# EasyEDA Pro project 无刷电调.epro

# Schematic Schematic1
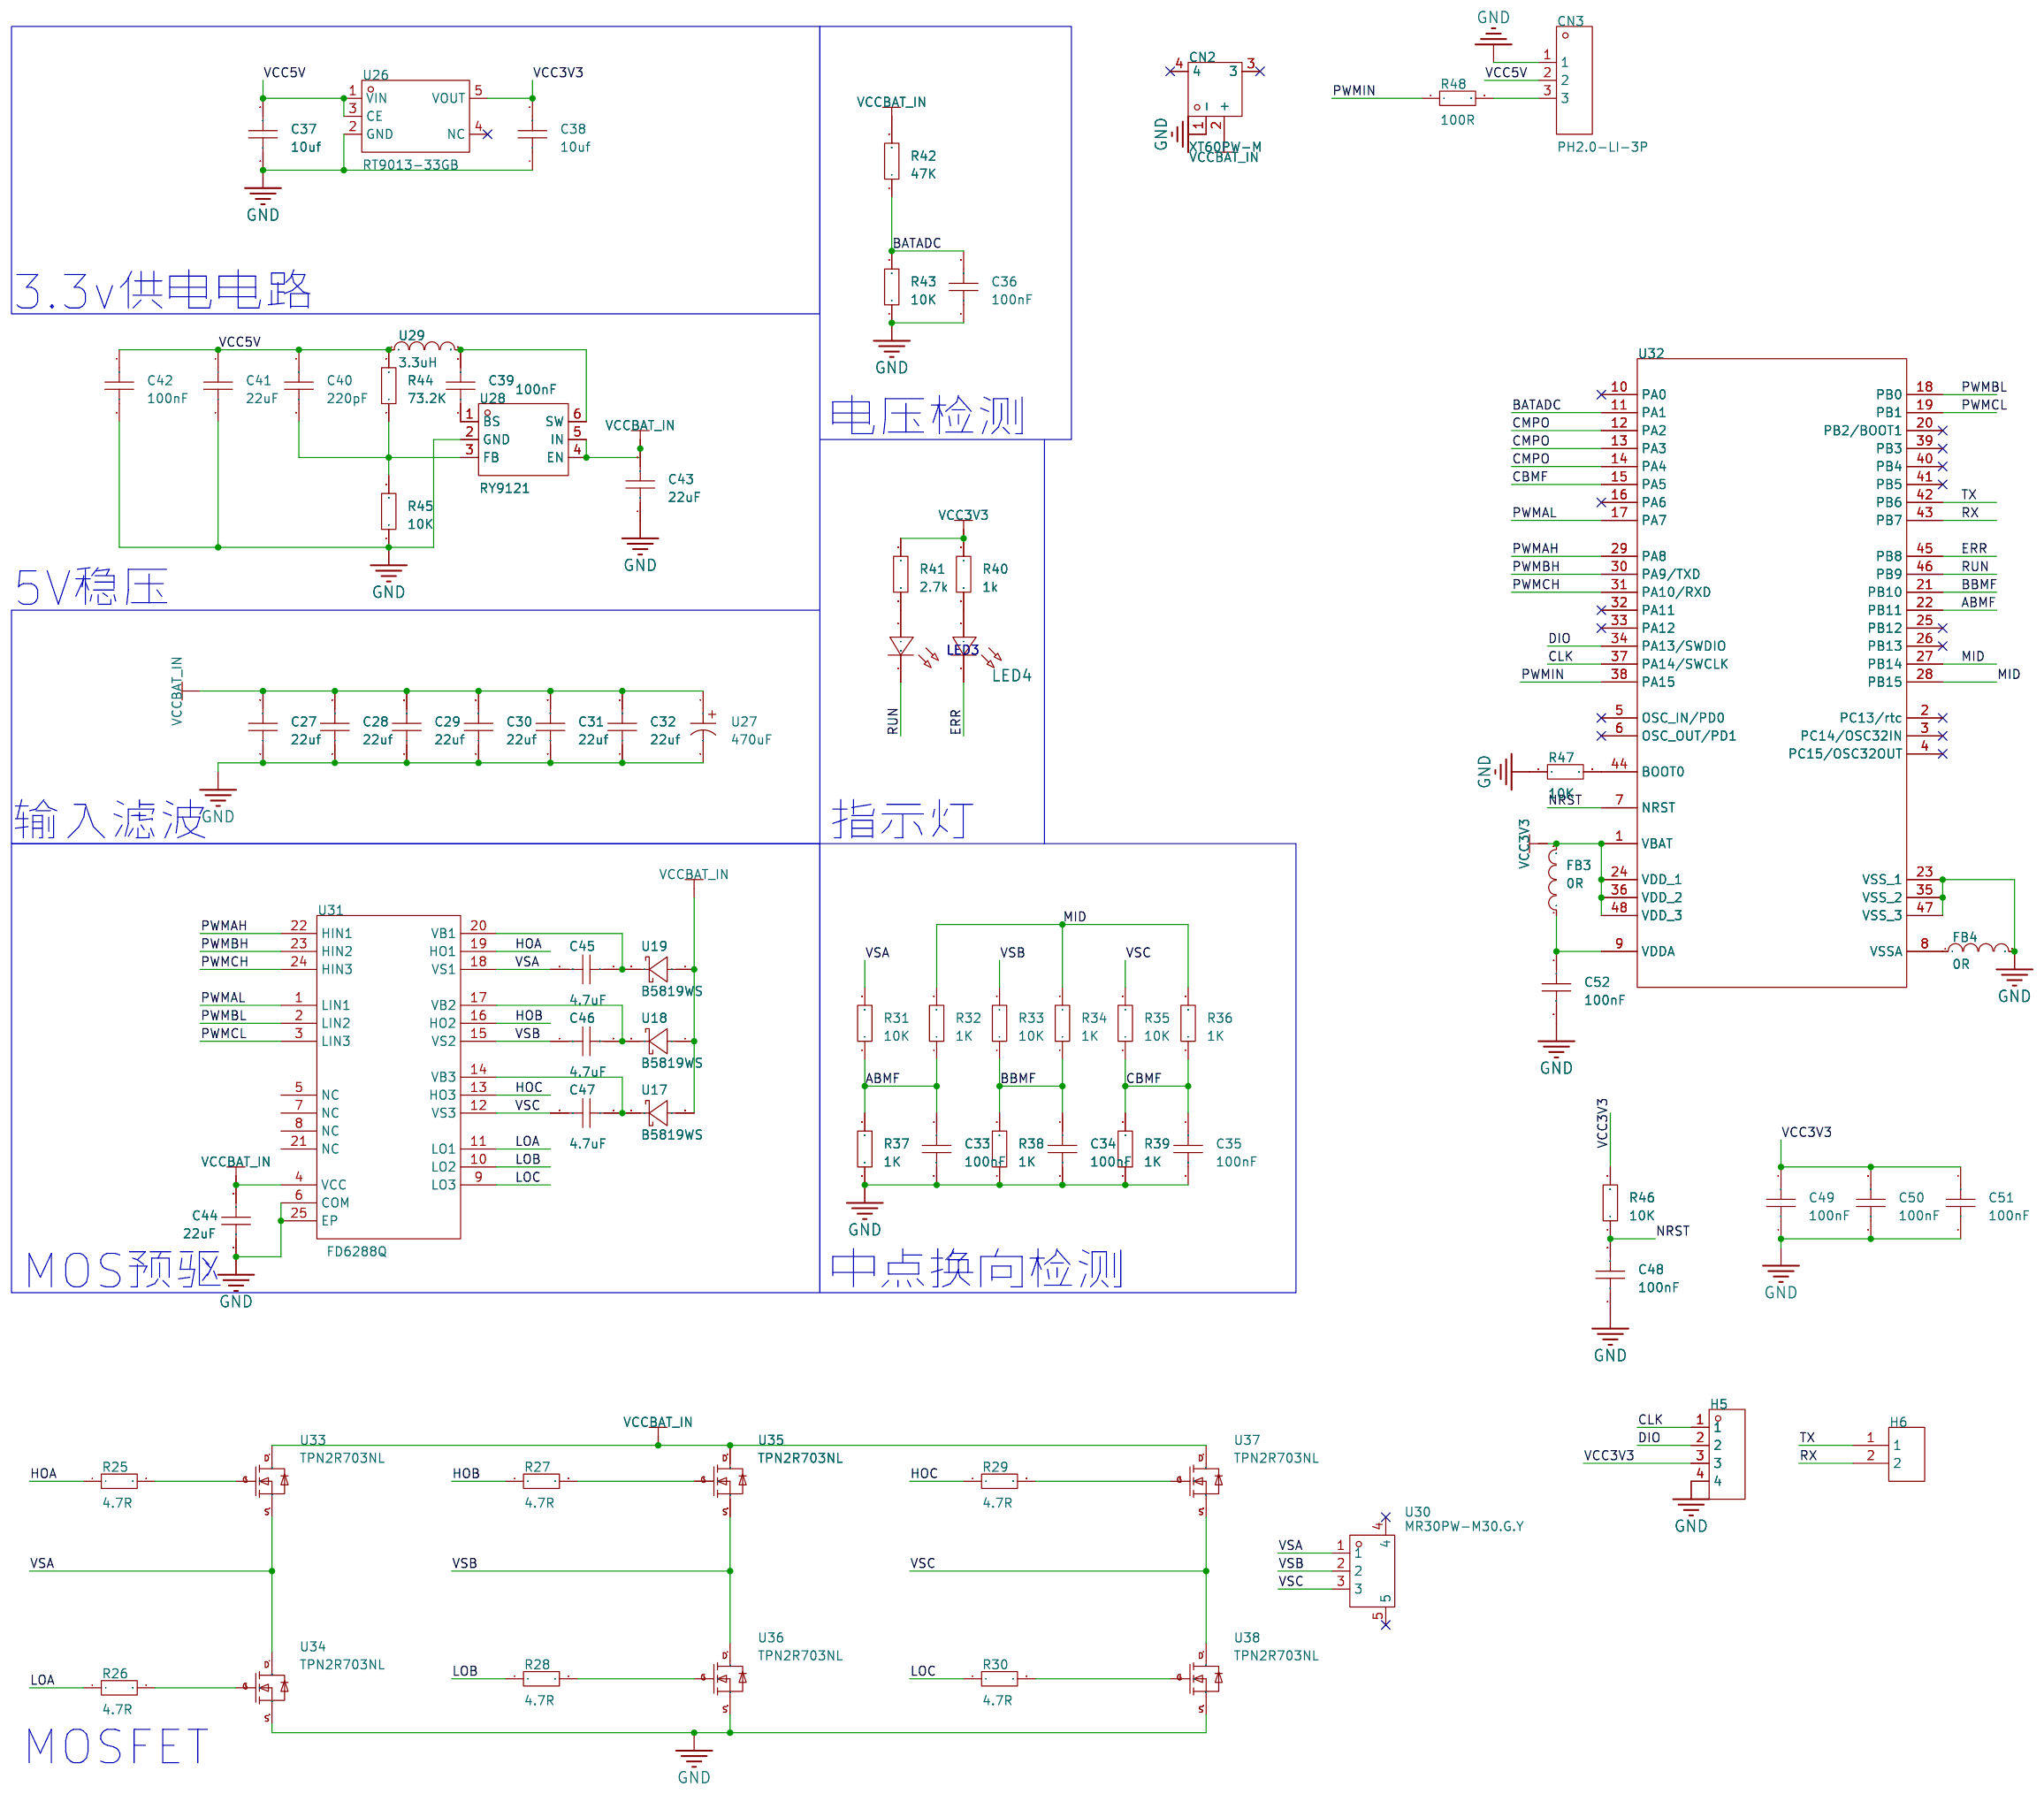
[diagram p0: schematic sheet]

## Parts
C27  22uf  [C0805]
C28  22uf  [C0805]
C29  22uf  [C0805]
C30  22uf  [C0805]
C31  22uf  [C0805]
C32  22uf  [C0805]
C33  100nF  [R0402]
C34  100nF  [R0402]
C35  100nF  [R0402]
C36  100nF  [R0402]
C37  10uf  [c1206]
C38  10uf  [c1206]
C39  100nF  [C0603]
C40  220pF  [C0603]
C41  22uF  [C0805]
C42  100nF  [C0603]
C43  22uF  [C0805]
C44  22uF  [C0805]
C45  4.7uF  [C0805]
C46  4.7uF  [C0805]
C47  4.7uF  [C0805]
C48  100nF  [C0603]
C49  100nF  [C0603]
C50  100nF  [C0603]
C51  100nF  [C0603]
C52  100nF  [C0603]
CN2  XT60PW-M  [CONN-TH_XT60PW-M]
CN3  PH2.0-LI-3P  [CONN-TH_3P-P2.00_HX20007-3A]
FB3  0R  [L0603]
FB4  0R  [L0603]
H5  -  [HDR-TH_4P-P2.54-V-F]
H6  -  [halfhole-2.0-1*2p]
LED3  -  [LED_0603]
LED4  -  [LED_0603]
R25  4.7R  [R0402]
R26  4.7R  [R0402]
R27  4.7R  [R0402]
R28  4.7R  [R0402]
R29  4.7R  [R0402]
R30  4.7R  [R0402]
R31  10K  [R0402]
R32  1K  [R0402]
R33  10K  [R0402]
R34  1K  [R0402]
R35  10K  [R0402]
R36  1K  [R0402]
R37  1K  [R0402]
R38  1K  [R0402]
R39  1K  [R0402]
R40  1k  [R0402]
R41  2.7k  [R0402]
R42  47K  [R0402]
R43  10K  [R0402]
R44  73.2K  [R0603]
R45  10K  [R0402]
R46  10K  [R0402]
R47  10K  [R0402]
R48  100R  [R0603]
U17  B5819WS  [sod-323_l1.7-w1.3-ls2.6-rd]
U18  B5819WS  [sod-323_l1.7-w1.3-ls2.6-rd]
U19  B5819WS  [sod-323_l1.7-w1.3-ls2.6-rd]
U26  RT9013-33GB  [SOT-23-5_L2.9-W1.6-P0.95-LS2.8-BR]
U27  470uF  [CAP-SMD_BD8.0-L8.3-W8.3-LS9.1-FD]
U28  RY9121  [SOT-23-6_L2.9-W1.6-P0.95-LS2.8-BR]
U29  3.3uH  [ind-smd_l4.2-w4.2_mcw-0420]
U30  MR30PW-M30.G.Y  [CONN-TH_MR30PW-M30-G-Y]
U31  FD6288Q  [qfn-24_l4.0-w4.0-p0.50-bl-ep2.6]
U32  -  [LQFP-48_L7.0-W7.0-P0.50-LS9.0-BL]
U33  TPN2R703NL  [TPN2R703NL]
U34  TPN2R703NL  [TPN2R703NL]
U35  TPN2R703NL  [TPN2R703NL]
U36  TPN2R703NL  [TPN2R703NL]
U37  TPN2R703NL  [TPN2R703NL]
U38  TPN2R703NL  [TPN2R703NL]

## Library data of the parts
C27-C52 = CAP_0603: Supplier Footprint: 0603
CN2 = XT60PW-M: 模型锂电连接器; LCSC Part Name: AMASS(艾迈斯)航模插头xt90连接器150公母对接pw锂电池公头 板插卧式XT60PW-M; Supplier Part: C98732; Manufacturer: AMASS(艾迈斯); JLCPCB Part Class: 扩展库; Datasheet: https://atta.szlcsc.com/upload/public/pdf/source/20180125/C98732_15168617837851301983.pdf; Supplier: LCSC
CN3 = PH2.0-LI-3P: Supplier Part: C9900014054; JLCPCB Part Class: 扩展库; Supplier: LCSC
FB3 FB4 = L_0603
H5 = HDR-F_2.54_1x4P: Supplier Part: C2718488; Supplier Footprint: 插件
H6 = HDR2.0-1*2
LED3 = LED_0603-G: Supplier Footprint: 0603
LED4 = LED_0603-R: Supplier Footprint: 0603
R25-R48 = Res_0603: Supplier Footprint: 0603
U17-U19 = B5819WS: Supplier Part: C9900015711; Supplier Footprint: DIODESCHOTTKY40V1ASOD123; JLCPCB Part Class: 扩展库; Supplier: LCSC
U26 = RT9013-33GB_C19268157: Supplier Part: C19268157; Manufacturer: TECH PUBLIC(台舟); Supplier Footprint: SOT-23-5; JLCPCB Part Class: 扩展库; Datasheet: https://atta.szlcsc.com/upload/public/pdf/source/20231201/9D78CA17020D67EC103F1AC7C29CF260.pdf; Supplier: LCSC
U27 = 865060353009: 容值:470uF;精度:±20%;额定电压:16V;纹波电流:390mA@120Hz;等效串联电阻:-;; LCSC Part Name: 470uF ±20% 16V; Supplier Part: C2164360; Manufacturer: Wurth(伍尔特); Supplier Footprint: SMD,D8xL10.5mm; JLCPCB Part Class: 扩展库; Datasheet: https://atta.szlcsc.com/upload/public/pdf/source/20210703/1335C8D8B2AE3C11A5627B11631E7D8B.pdf; Supplier: LCSC; Tolerance: ±20%; Rated Voltage: 16V; Ripple Current: 390mA@120Hz; φD: 8mm; L: 10.5mm; Lifetime @ Temp: 5000hrs@105℃; Operating Temperature: -55℃~+105℃
U28 = RY9121: 功能类型:降压型;输入电压:4.5V~17V;输出电流(最大值):2A;; Supplier Part: C2887854; Manufacturer: RYCHiP(蕊源); Supplier Footprint: SOT-23-6; JLCPCB Part Class: 扩展库; Datasheet: https://atta.szlcsc.com/upload/public/pdf/source/20210827/DF70F408E950B831DE30F072EB02455F.pdf; Supplier: LCSC; Function: 降压型; Input Voltage: 4.5V~17V; Output Current (Max): 2A; Switching Frequency: 500kHz
U29 = CDRH127R: Supplier Part: C9900013202; Supplier Footprint: 电感12X12; JLCPCB Part Class: 扩展库; Supplier: LCSC
U30 = MR30PW-M30.G.Y: LCSC Part Name: MR30PW20三芯PCB 弯插公金黄H=3mm; Supplier Part: C19268036; Manufacturer: AMASS(艾迈斯); Datasheet: https://atta.szlcsc.com/upload/public/pdf/source/20231221/E63D24EDC016665263C6304FABBAAC61.pdf; Supplier: LCSC
U31 = FD6288Q
U32 = ch32v203c8t6
U33-U38 = TPN2R703NL

## Nets
GND: C27.1 C28.1 C29.1 C30.1 C31.1 C32.1 C33.2 C34.2 C35.2 C36.1 C37.1 C38.1 C41.2 C42.2 C43.1 C44.1 C48.1 C49.1 C50.1 C51.1 C52.2 CN2.1(-) CN3.1 FB4.2 H5.4 R37.1 R38.1 R39.1 R43.1 R45.1 R47.1 U26.2(GND) U27.2 U28.2(GND) U31.6(COM) U31.25(EP) U32.23(VSS_1) U32.35(VSS_2) U32.47(VSS_3) U34.3(S) U36.3(S) U38.3(S)
VCC3V3: C38.2 C49.2 C50.2 C51.2 FB3.2 H5.3 R40.1 R41.1 R46.2 U26.5(VOUT) U32.1(VBAT) U32.24(VDD_1) U32.36(VDD_2) U32.48(VDD_3)
VCC5V: C37.2 C40.1 C41.1 C42.1 CN3.2 R44.2 U26.1(VIN) U26.3(CE) U29.1
VCCBAT_IN: C27.2 C28.2 C29.2 C30.2 C31.2 C32.2 C43.2 C44.2 CN2.2(+) R42.2 U17.1(A) U18.1(A) U19.1(A) U27.1 U28.4(EN) U28.5(IN) U31.4(VCC) U33.1(D) U35.1(D) U37.1(D)
ABMF: C33.1 R31.1 R32.1 R37.2 U32.22(PB11)
BATADC: C36.2 R42.1 R43.2 U32.11(PA1)
BBMF: C34.1 R33.1 R34.1 R38.2 U32.21(PB10)
CBMF: C35.1 R35.1 R36.1 R39.2 U32.15(PA5)
CLK: H5.1 U32.37(PA14/SWCLK)
CMPO: U32.12(PA2) U32.13(PA3) U32.14(PA4)
DIO: H5.2 U32.34(PA13/SWDIO)
ERR: LED4.1(C) U32.45(PB8)
HOA: R25.1 U31.19(HO1)
HOB: R27.1 U31.16(HO2)
HOC: R29.1 U31.13(HO3)
LOA: R26.1 U31.11(LO1)
LOB: R28.1 U31.10(LO2)
LOC: R30.1 U31.9(LO3)
MID: R32.2 R34.2 R36.2 U32.27(PB14) U32.28(PB15)
NRST: C48.2 R46.1 U32.7(NRST)
PWMAH: U31.22(HIN1) U32.29(PA8)
PWMAL: U31.1(LIN1) U32.17(PA7)
PWMBH: U31.23(HIN2) U32.30(PA9/TXD)
PWMBL: U31.2(LIN2) U32.18(PB0)
PWMCH: U31.24(HIN3) U32.31(PA10/RXD)
PWMCL: U31.3(LIN3) U32.19(PB1)
PWMIN: R48.1 U32.38(PA15)
RUN: LED3.1(C) U32.46(PB9)
RX: H6.2 U32.43(PB7)
TX: H6.1 U32.42(PB6)
VSA: C45.1 R31.2 U30.1 U31.18(VS1) U33.3(S) U34.1(D)
VSB: C46.1 R33.2 U30.2 U31.15(VS2) U35.3(S) U36.1(D)
VSC: C47.1 R35.2 U30.3 U31.12(VS3) U37.3(S) U38.1(D)
$1N2499: LED3.2(A) R41.2
$1N2500: LED4.2(A) R40.2
$1N2506: R25.2 U33.2(G)
$1N2508: R26.2 U34.2(G)
$1N2512: R30.2 U38.2(G)
$1N2514: C39.1 U28.1(BS)
$1N2519: C39.2 U28.6(SW) U29.2
$1N2520: C40.2 R44.1 R45.2 U28.3(FB)
$1N2563: C47.2 U17.2(K) U31.14(VB3)
$1N2564: C46.2 U18.2(K) U31.17(VB2)
$1N2565: C45.2 U19.2(K) U31.20(VB1)
$1N2616: R47.2 U32.44(BOOT0)
$1N2638: FB4.1 U32.8(VSSA)
$1N2639: C52.1 FB3.1 U32.9(VDDA)
$1N3039: R29.2 U37.2(G)
$1N3087: R27.2 U35.2(G)
$1N3148: R28.2 U36.2(G)
$1N3487: CN3.3 R48.2

Not connected (* = marked no-connect by the designer): CN2 3* 4*; U26 4(NC)*; U30 4* 5*; U31 5(NC) 7(NC) 8(NC) 21(NC); U32 2(PC13/rtc)* 3(PC14/OSC32IN)* 4(PC15/OSC32OUT)* 5(OSC_IN/PD0)* 6(OSC_OUT/PD1)* 10(PA0)* 16(PA6)* 20(PB2/BOOT1)* 25(PB12)* 26(PB13)* 32(PA11)* 33(PA12)* 39(PB3)* 40(PB4)* 41(PB5)*

## Notes on the sheet
- 3.3v供电电路
- 电压检测
- 5V稳压
- 输入滤波
- 指示灯
- MOS预驱
- 中点换向检测
- MOSFET

# Board PCB1
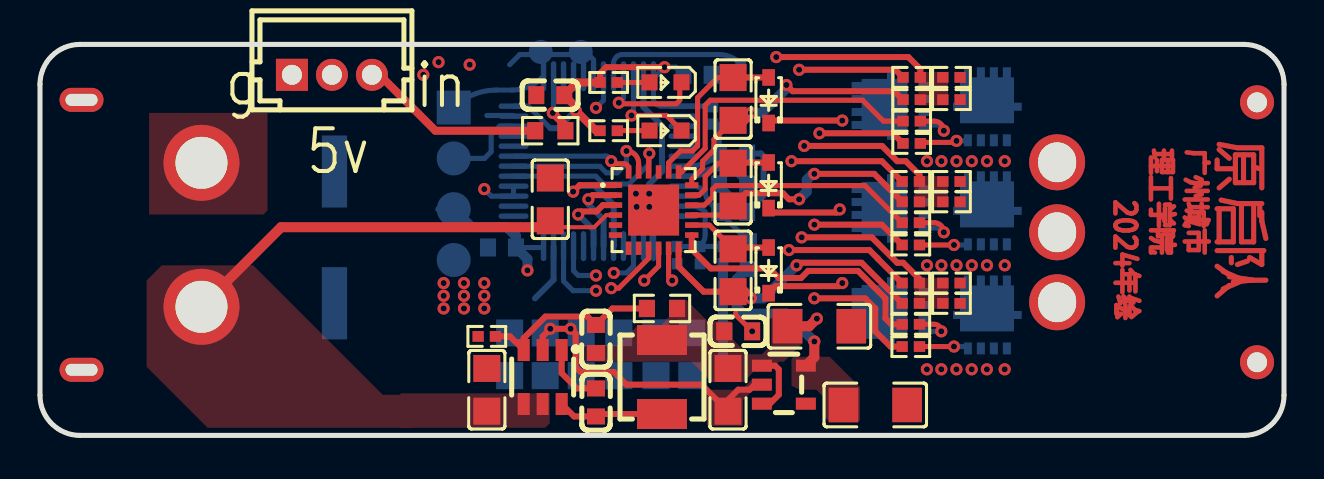
[diagram p1: board, top side]
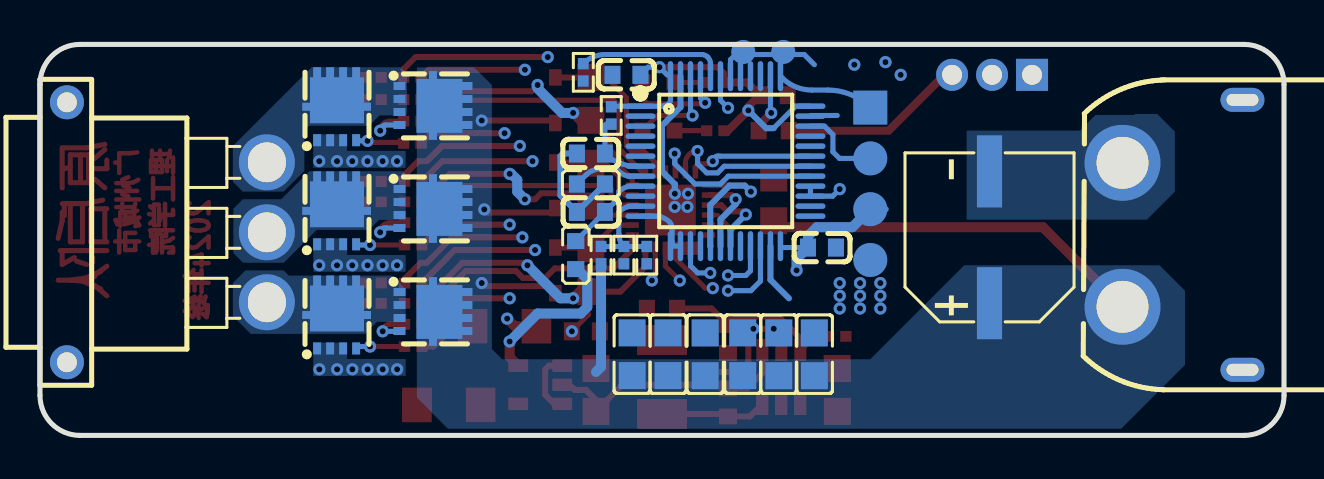
[diagram p2: board, bottom side, seen from below]

Outline 62.23 x 19.55 mm; copper layers: Top Layer, Inner1, Inner2, Bottom Layer. Coordinates in mm from the lower left corner of the outline.
Outline path: 0,17.55 0,2 arc(0.59,0.59) 2,0 60.23,0 arc(61.64,0.59) 62.23,2 62.23,17.55 arc(61.64,18.97) 60.23,19.55 2,19.55 arc(0.59,18.97) 0,17.55
Stack: Top Layer 0.035mm 外层铜厚1oz / Dielectric1 0.2104mm 7628 RC49% 8.6mil / Inner1 0.0152mm 内层铜厚 / Dielectric2 1.065mm 1.1mm H/HOZ 含铜 / Inner2 0.0152mm 内层铜厚 / Dielectric3 0.2104mm 7628 RC49% 8.6mil / Bottom Layer 0.035mm 外层铜厚1oz

## Design rules (mm)
template: JLCPCB Capability(Two Layers Board)
spacing copperThickness1oz (default): track to track 0.102, other pairs 0.152 to 0.3
spacing copperThickness2oz: track to track 0.203, other pairs 0.152 to 0.3
track width copperThickness1oz (default): min 0.127, default 0.254, max 2.54
track width copperThickness2oz: min 0.203, default 0.254, max 2.54
differential pair differentialPair (default): width min 0.127, default 0.254, max 2.54; gap min 0.152, default 0.152
via viaSize (default): diameter min 0.5, default 0.61, max 10; hole min 0.3, default 0.305, max 6.3

## Placement (name value [footprint] x y rotation side)
C27  22uf  [C0805]  23.49 4.06 270 bottom
C28  22uf  [C0805]  25.27 4.06 270 bottom
C29  22uf  [C0805]  27.07 4.06 270 bottom
C30  22uf  [C0805]  28.95 4.06 270 bottom
C31  22uf  [C0805]  30.81 4.06 270 bottom
C32  22uf  [C0805]  32.61 4.06 270 bottom
C33  100nF  [R0402]  45.59 17.91 0 top
C34  100nF  [R0402]  45.59 12.7 0 top
C35  100nF  [R0402]  45.59 7.62 0 top
C36  100nF  [R0402]  31.88 9.02 90 bottom
C37  10uf  [c1206]  38.99 5.46 180 top
C38  10uf  [c1206]  41.78 1.52 180 top
C39  100nF  [C0603]  27.81 1.65 270 top
C40  220pF  [C0603]  27.81 4.82 90 top
C41  22uF  [C0805]  34.41 2.28 270 top
C42  100nF  [C0603]  34.92 5.2 0 top
C43  22uF  [C0805]  22.35 2.28 270 top
C44  22uF  [C0805]  25.53 11.81 270 top
C45  4.7uF  [C0805]  34.67 16.82 90 top
C46  4.7uF  [C0805]  34.67 12.54 90 top
C47  4.7uF  [C0805]  34.67 8.25 90 top
C48  100nF  [C0603]  34.67 14.09 180 bottom
C49  100nF  [C0603]  23.11 9.4 0 bottom
C50  100nF  [C0603]  32.89 18.03 180 bottom
C51  100nF  [C0603]  25.53 17.02 0 top
C52  100nF  [C0603]  34.67 11.17 0 bottom
CN2  XT60PW-M  [CONN-TH_XT60PW-M]  5.08 10.03 0 bottom
CN3  PH2.0-LI-3P  [CONN-TH_3P-P2.00_HX20007-3A]  14.6 18.03 180 top
FB3  0R  [L0603]  35.43 9.02 270 bottom
FB4  0R  [L0603]  34.67 12.57 180 bottom
H5  -  [HDR-TH_4P-P2.54-V-F]  20.69 12.58 270 bottom
H6  -  [halfhole-2.0-1*2p]  23.49 18.54 270 bottom
LED3  run  [LED_0603]  31.24 15.24 180 top
LED4  err  [LED_0603]  31.24 17.65 180 top
R25  4.7R  [R0402]  43.6 15.72 0 top
R26  4.7R  [R0402]  43.6 14.6 0 top
R27  4.7R  [R0402]  43.56 10.64 0 top
R28  4.7R  [R0402]  43.56 9.52 0 top
R29  4.7R  [R0402]  43.56 5.56 0 top
R30  4.7R  [R0402]  43.56 4.44 0 top
R31  10K  [R0402]  43.6 16.79 180 top
R32  1K  [R0402]  43.6 17.91 180 top
R33  10K  [R0402]  43.56 11.68 180 top
R34  1K  [R0402]  43.56 12.7 180 top
R35  10K  [R0402]  43.56 6.6 180 top
R36  1K  [R0402]  43.56 7.62 180 top
R37  1K  [R0402]  45.59 16.79 180 top
R38  1K  [R0402]  45.59 11.68 180 top
R39  1K  [R0402]  45.59 6.6 180 top
R40  1k  [R0402]  28.45 17.65 0 top
R41  2.7k  [R0402]  28.45 15.24 0 top
R42  47K  [R0402]  34.16 9.02 270 bottom
R43  10K  [R0402]  33.02 9.02 90 bottom
R44  73.2K  [R0603]  31.11 6.35 0 top
R45  10K  [R0402]  22.35 4.95 0 top
R46  10K  [R0402]  33.65 16 90 bottom
R47  10K  [R0402]  35.05 18.16 90 bottom
R48  100R  [R0603]  25.53 15.24 180 top
U17  B5819WS  [sod-323_l1.7-w1.3-ls2.6-rd]  36.45 8.25 90 top
U18  B5819WS  [sod-323_l1.7-w1.3-ls2.6-rd]  36.45 12.51 90 top
U19  B5819WS  [sod-323_l1.7-w1.3-ls2.6-rd]  36.45 16.76 90 top
U26  RT9013-33GB  [SOT-23-5_L2.9-W1.6-P0.95-LS2.8-BR]  37.21 2.54 180 top
U27  470uF  [CAP-SMD_BD8.0-L8.3-W8.3-LS9.1-FD]  14.73 9.9 90 bottom
U28  RY9121  [SOT-23-6_L2.9-W1.6-P0.95-LS2.8-BR]  25.14 2.92 90 top
U29  3.3uH  [ind-smd_l4.2-w4.2_mcw-0420]  31.11 2.92 270 top
U30  MR30PW-M30.G.Y  [CONN-TH_MR30PW-M30-G-Y]  55.88 10.16 270 bottom
U31  FD6288Q  [qfn-24_l4.0-w4.0-p0.50-bl-ep2.6]  30.69 11.27 270 top
U32  -  [LQFP-48_L7.0-W7.0-P0.50-LS9.0-BL]  27.94 13.71 270 bottom
U33  -  [TPN2R703NL]  42.25 16.48 270 bottom
U34  -  [TPN2R703NL]  47.37 16.76 180 bottom
U35  -  [TPN2R703NL]  42.25 11.33 270 bottom
U36  -  [TPN2R703NL]  47.37 11.56 180 bottom
U37  -  [TPN2R703NL]  42.25 6.17 270 bottom
U38  -  [TPN2R703NL]  47.37 6.35 180 bottom

## Footprints (pads in the part's own frame, mm; a bottom-side part is the same pattern mirrored in y, then rotated)
C0603
  rect 0.8x0.9 smd: 1(-0.7,0) 2(0.7,0)
C0805
  rect 1.35x1.35 smd: 1(-1.063,0) 2(1.076,0)
c1206
  rect 1.485x1.728 smd: 1(-1.593,0) 2(1.593,0)
CAP-SMD_BD8.0-L8.3-W8.3-LS9.1-FD
  rect 3.61x1.26 smd: 1(-3.295,0) 2(3.295,0)
CONN-TH_3P-P2.00_HX20007-3A
  rect 1.6x1.6 hole 1: 1(2,0)
  round 1.6 hole 1: 2(0,0) 3(-2,0)
CONN-TH_MR30PW-M30-G-Y
  round 2.8 hole 1.995x1.9: 1(-3.5,5) 2(0,5) 3(3.5,5)
  round 1.7 hole 1: 4(6.5,-5) 5(-6.5,-5)
CONN-TH_XT60PW-M
  round 3.8 hole 2.6: 1(3,-3.6) 2(3,3.6)
  oval 2.2x1.2 hole 1.6x0.6: 3(-3,6.75) 4(-3,-6.75)
halfhole-2.0-1*2p
  round 1.2 smd: 1(-0.635,-3.556) 2(-0.635,-1.556)
HDR-TH_4P-P2.54-V-F
  rect 1.7x1.7 smd: 1(-3.81,0)
  round 1.7 smd: 2(-1.27,0) 3(1.27,0) 4(3.81,0)
ind-smd_l4.2-w4.2_mcw-0420
  rect 1.5x2.5 smd: 1(-1.85,0) 2(1.85,0)
L0603
  rect 0.8x0.864 smd: 1(-0.7,0) 2(0.7,0)
LED_0603
  rect 0.8x0.8 smd: 1(-0.851,-0.01) 2(0.75,-0.005)
LQFP-48_L7.0-W7.0-P0.50-LS9.0-BL
  oval 0.27x1.5 smd: 1(-2.75,-4.25) 2(-2.25,-4.25) 3(-1.75,-4.25) 4(-1.25,-4.25) 5(-0.75,-4.25) 6(-0.25,-4.25) 7(0.25,-4.25) 8(0.75,-4.25) 9(1.25,-4.25) 10(1.75,-4.25) 11(2.25,-4.25) 12(2.75,-4.25) 25(2.75,4.25) 26(2.25,4.25) 27(1.75,4.25) 28(1.25,4.25) 29(0.75,4.25) 30(0.25,4.25) 31(-0.25,4.25) 32(-0.75,4.25) 33(-1.25,4.25) 34(-1.75,4.25) 35(-2.25,4.25) 36(-2.75,4.25)
  oval 1.5x0.27 smd: 13(4.25,-2.75) 14(4.25,-2.25) 15(4.25,-1.75) 16(4.25,-1.25) 17(4.25,-0.75) 18(4.25,-0.25) 19(4.25,0.25) 20(4.25,0.75) 21(4.25,1.25) 22(4.25,1.75) 23(4.25,2.25) 24(4.25,2.75) 37(-4.25,2.75) 38(-4.25,2.25) 39(-4.25,1.75) 40(-4.25,1.25) 41(-4.25,0.75) 42(-4.25,0.25) 43(-4.25,-0.25) 44(-4.25,-0.75) 45(-4.25,-1.25) 46(-4.25,-1.75) 47(-4.25,-2.25) 48(-4.25,-2.75)
qfn-24_l4.0-w4.0-p0.50-bl-ep2.6
  rect 0.28x0.665 smd: 1(-1.25,-1.907) 2(-0.75,-1.907) 3(-0.25,-1.907) 4(0.25,-1.907) 5(0.75,-1.907) 6(1.25,-1.907) 13(1.25,1.907) 14(0.75,1.907) 15(0.25,1.907) 16(-0.25,1.907) 17(-0.75,1.907) 18(-1.25,1.907)
  rect 0.665x0.28 smd: 7(1.907,-1.25) 8(1.907,-0.75) 9(1.907,-0.25) 10(1.907,0.25) 11(1.907,0.75) 12(1.907,1.25) 19(-1.907,1.25) 20(-1.907,0.75) 21(-1.907,0.25) 22(-1.907,-0.25) 23(-1.907,-0.75) 24(-1.907,-1.25)
  rect 2.55x2.55 smd: 25(0,0)
R0402
  rect 0.566x0.54 smd: 1(-0.433,0) 2(0.433,0)
R0603
  rect 0.806x0.864 smd: 1(-0.753,0) 2(0.753,0)
sod-323_l1.7-w1.3-ls2.6-rd
  rect 0.83x0.63 smd: 1(-1.14,0) 2(1.14,0)
SOT-23-5_L2.9-W1.6-P0.95-LS2.8-BR
  rect 1x0.6 smd: 1(1.1,-0.95) 2(1.1,0) 3(1.1,0.95) 4(-1.1,0.95) 5(-1.1,-0.95)
SOT-23-6_L2.9-W1.6-P0.95-LS2.8-BR
  rect 1.1x0.6 smd: 1(1.35,-0.95) 2(1.35,0) 3(1.35,0.95) 4(-1.35,0.95) 5(-1.35,0) 6(-1.35,-0.95)
TPN2R703NL
  rect 0.6x0.4 smd: 1(-1.44,-0.325) 1(1.4,-0.325)
  rect 0.4x0.6 smd: 1(-0.995,1.35) 1(-0.345,1.35) 1(0.305,1.35) 1(0.955,1.35) 2(0.955,-2) 3(-0.995,-2) 3(-0.345,-2) 3(0.305,-2)
  rect 2.7x2.3 smd: 1(0,0)

## Nets
As in the schematic.

Pads without a net: CN2 3 4; U26 4; U30 4 5; U31 5 7 8 21; U32 2 3 4 5 6 10 16 20 25 26 32 33 39 40 41

## Via types
v1: diameter 0.61, hole 0.305, Top Layer to Bottom Layer, 83 vias

## Routing (per net, layer and track width the routed paths; a pad name or vN(x,y) marks a point on that pad's centre or on a via; arc(x,y) is an arc through that point)
GND: length 33.5
  Top Layer w0.254: v1(35.62,5.2) 34.8,6.03 34.8,6.09
  Top Layer w0.3: U26.2 35.75,2.54 35.49,2.28 34.92,2.28 34.41,1.78 C41.2 33.09,2.54 29.34,2.54 28.7,3.17 27.05,3.17 26.79,3.43 26.79,5.08 v1(26.54,5.33) v1(25.53,5.33) 25.14,4.95 U28.2
  Bottom Layer w0.254: U32.35 23.65,16 22.35,16
  Bottom Layer w0.3: v1(30.47,12.09) 30.47,12.56 31.11,13.21 31.11,15.49 30.19,16.42 U32.47 ; U32.23 25.69,7.78 24.76,6.86 ; C48.1 36.07,14.09 36.19,13.97 36.19,12 C52.2 35.37,11.17 FB4.2
  vias: v1(19.18,18.03) v1(19.94,18.67) v1(20.19,7.62) v1(20.19,6.98) v1(20.19,6.35) v1(21.21,7.62) v1(21.21,6.98) v1(21.21,6.35) v1(22.22,7.62) v1(22.22,6.98) v1(22.22,6.35) v1(29.81,12.09) v1(29.84,11.43) v1(30.48,11.43) v1(44.37,13.71) v1(44.37,8.51) v1(44.36,3.31) v1(45.09,13.71) v1(45.09,8.51) v1(45.08,3.31) v1(45.84,13.71) v1(45.84,8.51) v1(45.84,3.31) v1(46.61,13.71) v1(46.61,8.51) v1(46.6,3.31) v1(47.36,3.31) v1(47.37,13.71) v1(47.37,8.51) v1(48.26,13.71) v1(48.26,8.51) v1(48.25,3.31)
VCC3V3: length 68.9
  Top Layer w0.3: R40.1 28.01,18.11 28.32,18.41 v1(31.24,18.41)
  Top Layer w0.4: R40.1 26.86,17.65 C51.2 26.79,16.45 v1(26.79,16.25) 27.81,15.24 R41.1
  Top Layer w0.5: v1(38.73,4.7) 38.73,3.91 U26.5
  Inner1 w0.8: v1(38.73,4.7) 36.83,2.79 25.53,2.79 24.38,3.94 v1(24.38,8.25)
  Inner2 w0.5: v1(26.79,16.25) 26.79,15.24 26.16,14.6 22.35,14.6 20.57,12.83 20.57,12.06 v1(24.38,8.25)
  Bottom Layer w0.254: C49.2 25.12,9.4 U32.24 ; 25.53,15.36 24.43,16.46 U32.36 ; C50.2 31.81,18.41 31.23,18.41 30.85,18.03 arc(30.76,18.01) U32.48 30.69,16.81 arc(30.78,16.6) 30.99,16.51 arc(31,16.48) 31.03,16.46 U32.1 33.58,16.46 arc(33.62,16.46) R46.2
  Bottom Layer w0.3: 25.53,15.36 25.91,15.36 v1(26.79,16.25) ; H5.3 19.93,11.31
  Bottom Layer w0.5: v1(24.38,8.25) 24.38,8.83 C49.2 23.81,9.97 23.37,10.41 21.6,10.41 H5.3 ; v1(38.73,4.7) 37.34,6.09 35.18,6.09 34.85,6.42 34.85,7.81 35.35,8.31 FB3.2
VCC5V: length 37.5
  Top Layer w0.3: U26.1 36.77,3.49 36.96,3.3 36.96,2.03 36.51,1.59 36.11,1.59
  Top Layer w0.5: C37.2 38.48,5.46 v1(38.86,5.84)
  Inner1 w0.5: v1(38.86,5.84) 38.61,5.84 36.32,3.55 29.35,3.55 25.4,7.51 25.4,9.02 24,10.41 21.84,10.41 14.6,17.65 14.6,18.41
VCCBAT_IN: length 39.7
  Top Layer w0.2: C44.2 25.85,10.41 27.72,10.41 28.33,11.02 U31.4
  Top Layer w0.3: U19.1 36.57,15.75 v1(40.13,15.75) ; U18.1 36.67,11.15 39.85,11.15 v1(40,11.3) ; v1(40.13,7.62) 39.98,7.46 36.8,7.46 U17.1
  Top Layer w0.5: CN2.2 12.06,10.41 25.2,10.41 C44.2
  Bottom Layer w0.5: R42.2 34.16,3.43 34.41,3.17
ABMF: length 31.4
  Top Layer w0.3: v1(36.83,18.92) 43.44,18.92 44.03,18.33 R32.1
  Inner1 w0.254: v1(36.83,18.92) 33.34,18.92 29.53,15.11 28.06,15.11 26.08,13.13 26.08,10.49 27.05,9.52 27.05,7.62 27.43,7.24 v1(27.81,7.24)
  Bottom Layer w0.254: v1(27.81,7.24) 26.67,7.24 26.19,7.72 U32.22
BATADC: length 5.2
  Bottom Layer w0.254: R43.2 C36.2 ; R43.2 R42.1 ; R43.2 arc(33.21,9.73) 33.27,10.06 33.27,11.17 arc(32.95,11.39) 32.57,11.46 U32.11
BBMF: length 26.1
  Top Layer w0.3: v1(38.22,14.48) 42.12,14.48 42.88,13.71 43.31,13.71 43.99,13.03 R34.1
  Inner1 w0.3: v1(38.22,14.48) 35.99,14.48 33.78,12.27 33.78,8.63 32.26,7.11 31.27,7.11 30.86,7.52 30.86,8 30.12,8.73 28.29,8.73 27.81,8.25 v1(27.81,8)
  Bottom Layer w0.254: U32.21 26.69,8.23 26.92,8 v1(27.81,8)
CBMF: length 20.9
  Top Layer w0.3: v1(38.1,9.9) 41.61,9.9 42.88,8.63 43.18,8.63 43.99,7.82 R36.1
  Inner1 w0.3: v1(28.7,8.13) 28.83,8.13 29.41,7.55 29.41,7.17 30.22,6.35 32.57,6.35 36.12,9.9 v1(38.1,9.9)
  Bottom Layer w0.254: v1(28.7,8.13) 29.34,8.13 29.69,8.48 U32.15
CLK: length 4.9
  Bottom Layer w0.254: U32.37 25.11,17.89 arc(24.43,17.43) 23.62,17.27 22.81,17.27 arc(21.67,17.04) H5.1
CMPO: length 3.3
  Bottom Layer w0.254: U32.14 U32.13 arc(30.63,9.56) 30.6,9.66 30.61,9.67 30.61,10.36 30.6,10.36 arc(30.64,10.53) 30.73,10.67 arc(31.06,10.89) 31.45,10.96 U32.12
DIO: length 4.2
  Bottom Layer w0.254: U32.34 22.99,15.46 22.56,15.04 22.56,14.18 22.24,13.85 H5.2
ERR: length 5.5
  Top Layer w0.254: LED4.1 32,17.57 32,16.76 31.82,16.58 29,16.58 v1(28.95,16.64)
  Bottom Layer w0.254: U32.45 29.19,16.87 v1(28.95,16.64)
HOA: length 14.4
  Top Layer w0.254: R25.1 42.19,15.72 41.15,16.76 33.53,16.76 33.27,16.51 33.27,14.35 32.1,13.17 U31.19
HOB: length 11.9
  Top Layer w0.254: U31.16 33.23,11.52 33.65,11.94 33.65,12.32 33.83,12.49 41.27,12.49 R27.1
HOC: length 13.7
  Top Layer w0.3: U31.13 32.6,9.31 33.55,8.35 36.47,8.35 36.96,7.87 38.07,7.87 38.42,8.23 40.92,8.23 42.29,6.86 42.29,5.86 42.59,5.56 R29.1
LOA: length 18.7
  Top Layer w0.254: v1(31.62,7.75) 31.44,7.92 31.44,9.36
  Top Layer w0.3: R26.1 42.66,15.11 v1(38.99,15.11)
  Inner1 w0.254: v1(38.99,15.11) 35.91,15.11 33.4,12.6 33.4,8.79 32.36,7.75 v1(31.62,7.75)
LOB: length 17.4
  Top Layer w0.254: v1(30.22,7.75) 30.94,8.46 30.94,9.36
  Top Layer w0.3: v1(38.73,10.54) 42.11,10.54 R28.1
  Inner1 w0.254: v1(30.22,7.75) 30.22,7.49 30.98,6.73 32.41,6.73 36.22,10.54 v1(38.73,10.54)
LOC: length 20.2
  Top Layer w0.254: v1(28.57,7.36) 28.95,7.36 30.44,8.85 30.44,9.36
  Top Layer w0.3: v1(38.73,6.86) 41.27,6.86 41.78,6.35 41.78,5.2 42.54,4.44 R30.1
  Inner1 w0.254: v1(38.73,6.86) 37.85,5.97 29.96,5.97 v1(28.57,7.36)
MID: length 46.2
  Top Layer w0.3: R36.2 41.9,8.84 41.9,8.85 41.49,9.27 v1(37.46,9.27) ; v1(37.97,18.29) 42.79,18.29 R32.2 ; v1(37.59,13.71) 42.11,13.71 R34.2
  Inner2 w0.4: v1(37.59,13.71) 36.96,13.08 36.96,9.78 v1(37.46,9.27) ; v1(37.59,13.71) 37.21,14.09 37.21,15.36 38.63,16.78 38.63,17.63 v1(37.97,18.29) ; v1(37.59,13.71) 31.88,13.71 31.11,12.95 22.86,12.95 v1(22.22,12.32)
  Bottom Layer w0.254: U32.28 U32.27 22.58,11.96 v1(22.22,12.32)
NRST: length 3.4
  Bottom Layer w0.254: U32.7 32.45,13.46 arc(33.27,13.63) C48.2 33.97,15.5 33.91,15.57
PWMAH: length 8.8
  Top Layer w0.254: U31.22 30.44,13.89 arc(30.44,13.99) v1(30.48,14.09)
  Bottom Layer w0.254: v1(30.48,14.09) 30.48,13.59 29.46,12.57 28.19,12.57 27.8,12.96 U32.29
PWMAL: length 6.9
  Top Layer w0.3: v1(26.67,12.19) 27,12.52 U31.1
  Bottom Layer w0.3: v1(26.67,12.19) 26.97,12.49 27.74,12.49 28.7,11.53 28.7,9.48 U32.17
PWMBH: length 8
  Top Layer w0.254: U31.23 29.94,13.61 arc(29.77,14.04) v1(29.34,14.22)
  Bottom Layer w0.254: U32.30 23.69,13.46 28,13.46 28.33,13.13 28.88,13.13 29.34,13.59 v1(29.34,14.22)
PWMBL: length 4.1
  Top Layer w0.3: U31.2 27.64,12.02 v1(27.43,11.81)
  Bottom Layer w0.3: U32.18 28.19,10.8 27.43,11.56 v1(27.43,11.81)
PWMCH: length 6.4
  Top Layer w0.254: U31.24 29.44,13.35 arc(29.37,13.52) 29.21,13.59 28.7,13.59 arc(28.56,13.57) v1(28.57,13.71)
  Bottom Layer w0.254: U32.31 28.2,13.96 arc(28.45,13.93) v1(28.57,13.71)
PWMCL: length 4
  Top Layer w0.3: v1(26.92,11.05) 27.08,11.2 27.84,11.2 28.15,11.52 U31.3
  Bottom Layer w0.3: v1(26.92,11.05) 27.69,10.28 U32.19
PWMIN: length 3
  Top Layer w0.4: R48.1 26.28,15.5 v1(25.65,16.13)
  Bottom Layer w0.254: v1(25.65,16.13) 25.69,16.16 U32.38
RUN: length 4.8
  Top Layer w0.254: LED3.1 31.34,16 v1(29.59,16)
  Bottom Layer w0.254: U32.46 29.69,16.1 v1(29.59,16)
RX: length 9
  Inner1 w0.3: v1(21.49,18.54) 25.65,18.54 v1(27.81,16.38)
  Bottom Layer w0.254: v1(27.81,16.38) 28.19,16.76 U32.43
TX: length 5.3
  Bottom Layer w0.254: U32.42 27.69,18.79 27.43,19.05 24,19.05 23.49,18.54
VSA: length 28.9
  Top Layer w0.254: U31.18 32.6,12.81 33.15,13.36 33.15,13.71 33.71,14.28 33.71,14.8 C45.1
  Top Layer w0.3: v1(37.34,17.52) 37.65,17.21 42.74,17.21 43.16,16.79 R31.2
  Top Layer w0.5: v1(35.56,16.13) 35.19,15.76 C45.1
  Inner1 w0.5: U30.1 47.27,17.27 38.48,17.27 38.22,17.52 v1(37.34,17.52)
  Bottom Layer w0.5: v1(37.34,17.52) 37.34,17.35 36.11,16.13 v1(35.56,16.13)
VSB: length 25.9
  Top Layer w0.254: C46.1 34.21,11.02 U31.15
  Top Layer w0.3: v1(37.97,11.81) 37.46,11.81 37.16,12.11 35.31,12.11 C46.1 ; v1(38.73,13.08) 41.73,13.08 R33.2
  Inner1 w0.5: v1(38.73,13.08) 39.62,12.19 48.85,12.19 U30.2
  Bottom Layer w0.5: v1(38.73,13.08) 38.65,13.08 38.35,12.78 38.35,12.19 v1(37.97,11.81)
VSC: length 28.1
  Top Layer w0.3: C47.1 33.19,7.19 31.94,8.44 31.94,9.36 ; v1(37.84,8.51) 37.97,8.63 41.09,8.63 R35.2
  Top Layer w0.5: v1(35.56,6.86) 35.22,7.19 C47.1
  Inner1 w0.5: U30.3 50.17,7.36 42.03,7.36 40.89,8.51 v1(37.84,8.51)
  Bottom Layer w0.5: v1(37.84,8.51) 36.19,6.86 v1(35.56,6.86)
$1N2499: length 1.6
  Top Layer w0.254: R41.2 28.88,15.24 LED3.2
$1N2500: length 1.6
  Top Layer w0.254: R40.2 30.49,17.65 30.49,17.66
$1N2506: length 2.6
  Top Layer w0.254: R25.2 44.73,15.72 arc(45.07,15.58) v1(45.21,15.24)
  Bottom Layer w0.254: U33.2 44.92,15.52 arc(45.13,15.44) v1(45.21,15.24)
$1N2508: length 2.5
  Top Layer w0.254: R26.2 44.08,14.65 45.67,14.65 45.72,14.6 arc(45.81,14.64) v1(45.84,14.73)
  Bottom Layer w0.254: v1(45.84,14.73) 46.38,14.73 arc(46.4,14.74) U34.2
$1N2512: length 2.5
  Top Layer w0.254: v1(45.72,4.44) R30.2
  Bottom Layer w0.254: v1(45.72,4.44) 46.32,4.44 arc(46.39,4.42) U38.2
$1N2514: length 3.2
  Top Layer w0.3: C39.1 26.86,2.35 26.09,3.11 U28.1
$1N2519: length 5.3
  Top Layer w0.3: U29.2 27.93,1.07 C39.2 26.71,0.95 U28.6
$1N2520: length 9.4
  Top Layer w0.3: R44.1 28.63,6.35 C40.2 27.4,5.94 25.27,5.94 24.19,4.86 U28.3 23.51,4.95 R45.2
$1N2563: length 4.4
  Top Layer w0.254: U31.14 33.48,10.52 C47.2
  Top Layer w0.3: U17.2 34.73,9.39 C47.2
$1N2564: length 4.9
  Top Layer w0.254: U31.17 32.97,12.02 33.27,12.32 33.27,12.95 33.93,13.61 C46.2
  Top Layer w0.3: U18.2 34.7,13.65 C46.2
$1N2565: length 8.6
  Top Layer w0.254: U31.20 31.44,13.63 32.03,14.22 32.64,14.22 32.89,14.48 32.89,16.89 33.9,17.9 34.67,17.9
  Top Layer w0.3: U19.2 34.68,17.9 34.67,17.9
$1N2616: length 7.4
  Bottom Layer w0.254: U32.44 28.69,18.59 arc(28.72,18.77) 28.83,18.92 arc(28.97,19.02) 29.13,19.05 33.95,19.05 arc(34.54,18.93) R47.2
$1N2638: length 3.5
  Bottom Layer w0.254: FB4.1 34.92,13.02 arc(34.57,13.25) 34.16,13.33 33.58,13.33 arc(33.41,13.3) 33.27,13.21 arc(33,13.03) 32.69,12.96 U32.8
$1N2639: length 4.5
  Bottom Layer w0.254: U32.9 32.61,12.46 arc(32.97,12.39) 33.27,12.19 arc(33.33,11.9) 33.5,11.65 C52.1 35.43,9.72 arc(35.43,9.72) FB3.1
$1N3039: length 2.1
  Top Layer w0.254: R29.2 44.73,5.56 arc(44.98,5.45) v1(45.08,5.2)
  Bottom Layer w0.254: v1(45.08,5.2) 44.26,5.2 arc(44.25,5.21) U37.2
$1N3087: length 2.6
  Top Layer w0.254: R27.2 44.73,10.64 arc(45.07,10.5) v1(45.21,10.16)
  Bottom Layer w0.254: U35.2 44.87,10.37 arc(45.09,10.35) v1(45.21,10.16)
$1N3148: length 2.4
  Top Layer w0.254: R28.2 v1(45.72,9.52)
  Bottom Layer w0.254: U36.2 46.38,9.52 v1(45.72,9.52)
$1N3487: length 9.5
  Top Layer w0.4: 16.6,18.41 19.78,15.24 R48.2

## Copper pours and planes (outline as drawn; the poured copper is in the pictures)
GND on Top Layer: -17.15,26.16 67.56,26.16 67.56,-10.42 -17.15,-10.42
GND on Top Layer: 33.36,2.79 36.6,2.79 36.6,0.47 33.36,0.47
GND on Top Layer: 5.46,16.13 11.38,16.13 11.38,11.05 5.46,11.05
GND on Bottom Layer: 43.94,3.82 46.99,3.82 46.99,2.98 43.94,2.98
GND on Bottom Layer: 43.94,14.23 46.99,14.23 46.99,13.39 43.94,13.39
GND on Bottom Layer: -20.19,30.73 75.06,30.73 75.06,-14.61 -20.19,-14.61
GND on Bottom Layer: 46.87,4.64 48.56,4.64 48.56,2.97 46.87,2.97
GND on Bottom Layer: 43.94,9.02 46.99,9.02 46.99,8.18 43.94,8.18
GND on Bottom Layer: 46.87,15.06 48.56,15.06 48.56,13.39 46.87,13.39
GND on Bottom Layer: 46.86,9.86 48.55,9.86 48.55,8.18 46.86,8.18
GND on Bottom Layer: 5.46,16.07 15.87,16.07 15.87,10.79 5.46,10.79
GND on Inner1: -26.29,35.3 79.88,35.3 79.88,-15.24 -26.29,-15.24
GND on Inner2: -32.13,43.18 83.94,43.18 83.94,-19.69 -32.13,-19.69
VCC3V3 on Top Layer: 37.59,3.94 41.02,3.94 41.02,0.63 37.59,0.63
VCC5V on Top Layer: 27.27,6.77 35.19,6.77 35.19,2.66 27.27,2.66
VCC5V on Top Layer: 33.65,6.35 38.1,6.35 38.1,2.69 33.65,2.69
VCCBAT_IN on Top Layer: 18.03,2.1 25.5,2.1 25.5,0.38 18.03,0.38
VCCBAT_IN on Top Layer: 5.33,8.51 19.18,8.51 19.18,0.38 5.33,0.38
VCCBAT_IN on Bottom Layer: 4.95,18.4 43.37,18.4 43.37,0.33 4.95,0.33
ABMF on Top Layer: 43.95,18.17 45.42,18.17 45.42,16.5 43.95,16.5
BBMF on Top Layer: 43.73,12.97 45.42,12.97 45.42,11.41 43.73,11.41
CBMF on Top Layer: 43.73,7.87 45.46,7.87 45.46,6.33 43.73,6.33
VSA on Bottom Layer: 43.87,18.41 52.58,18.41 52.58,12.19 43.87,12.19
VSB on Bottom Layer: 43.94,13.21 52.55,13.21 52.55,8.63 43.94,8.63
VSC on Bottom Layer: 43.94,8.25 52.58,8.25 52.58,5.08 43.94,5.08

## Text on the board
Top Layer: 2024年绘 | 广州城市 / 理工学院 | 原启队
Top Silkscreen Layer: g | 5v | in
